# EasyEDA schematic SCH_MY-first-PCB_2026-09-03.json
TITLE: 5V Linear Power Supply; REV: 1.0; Date: 2026-09-03; Sheet: 1/1; Drawn By: Neeraj R; Company: neeraj-r-io
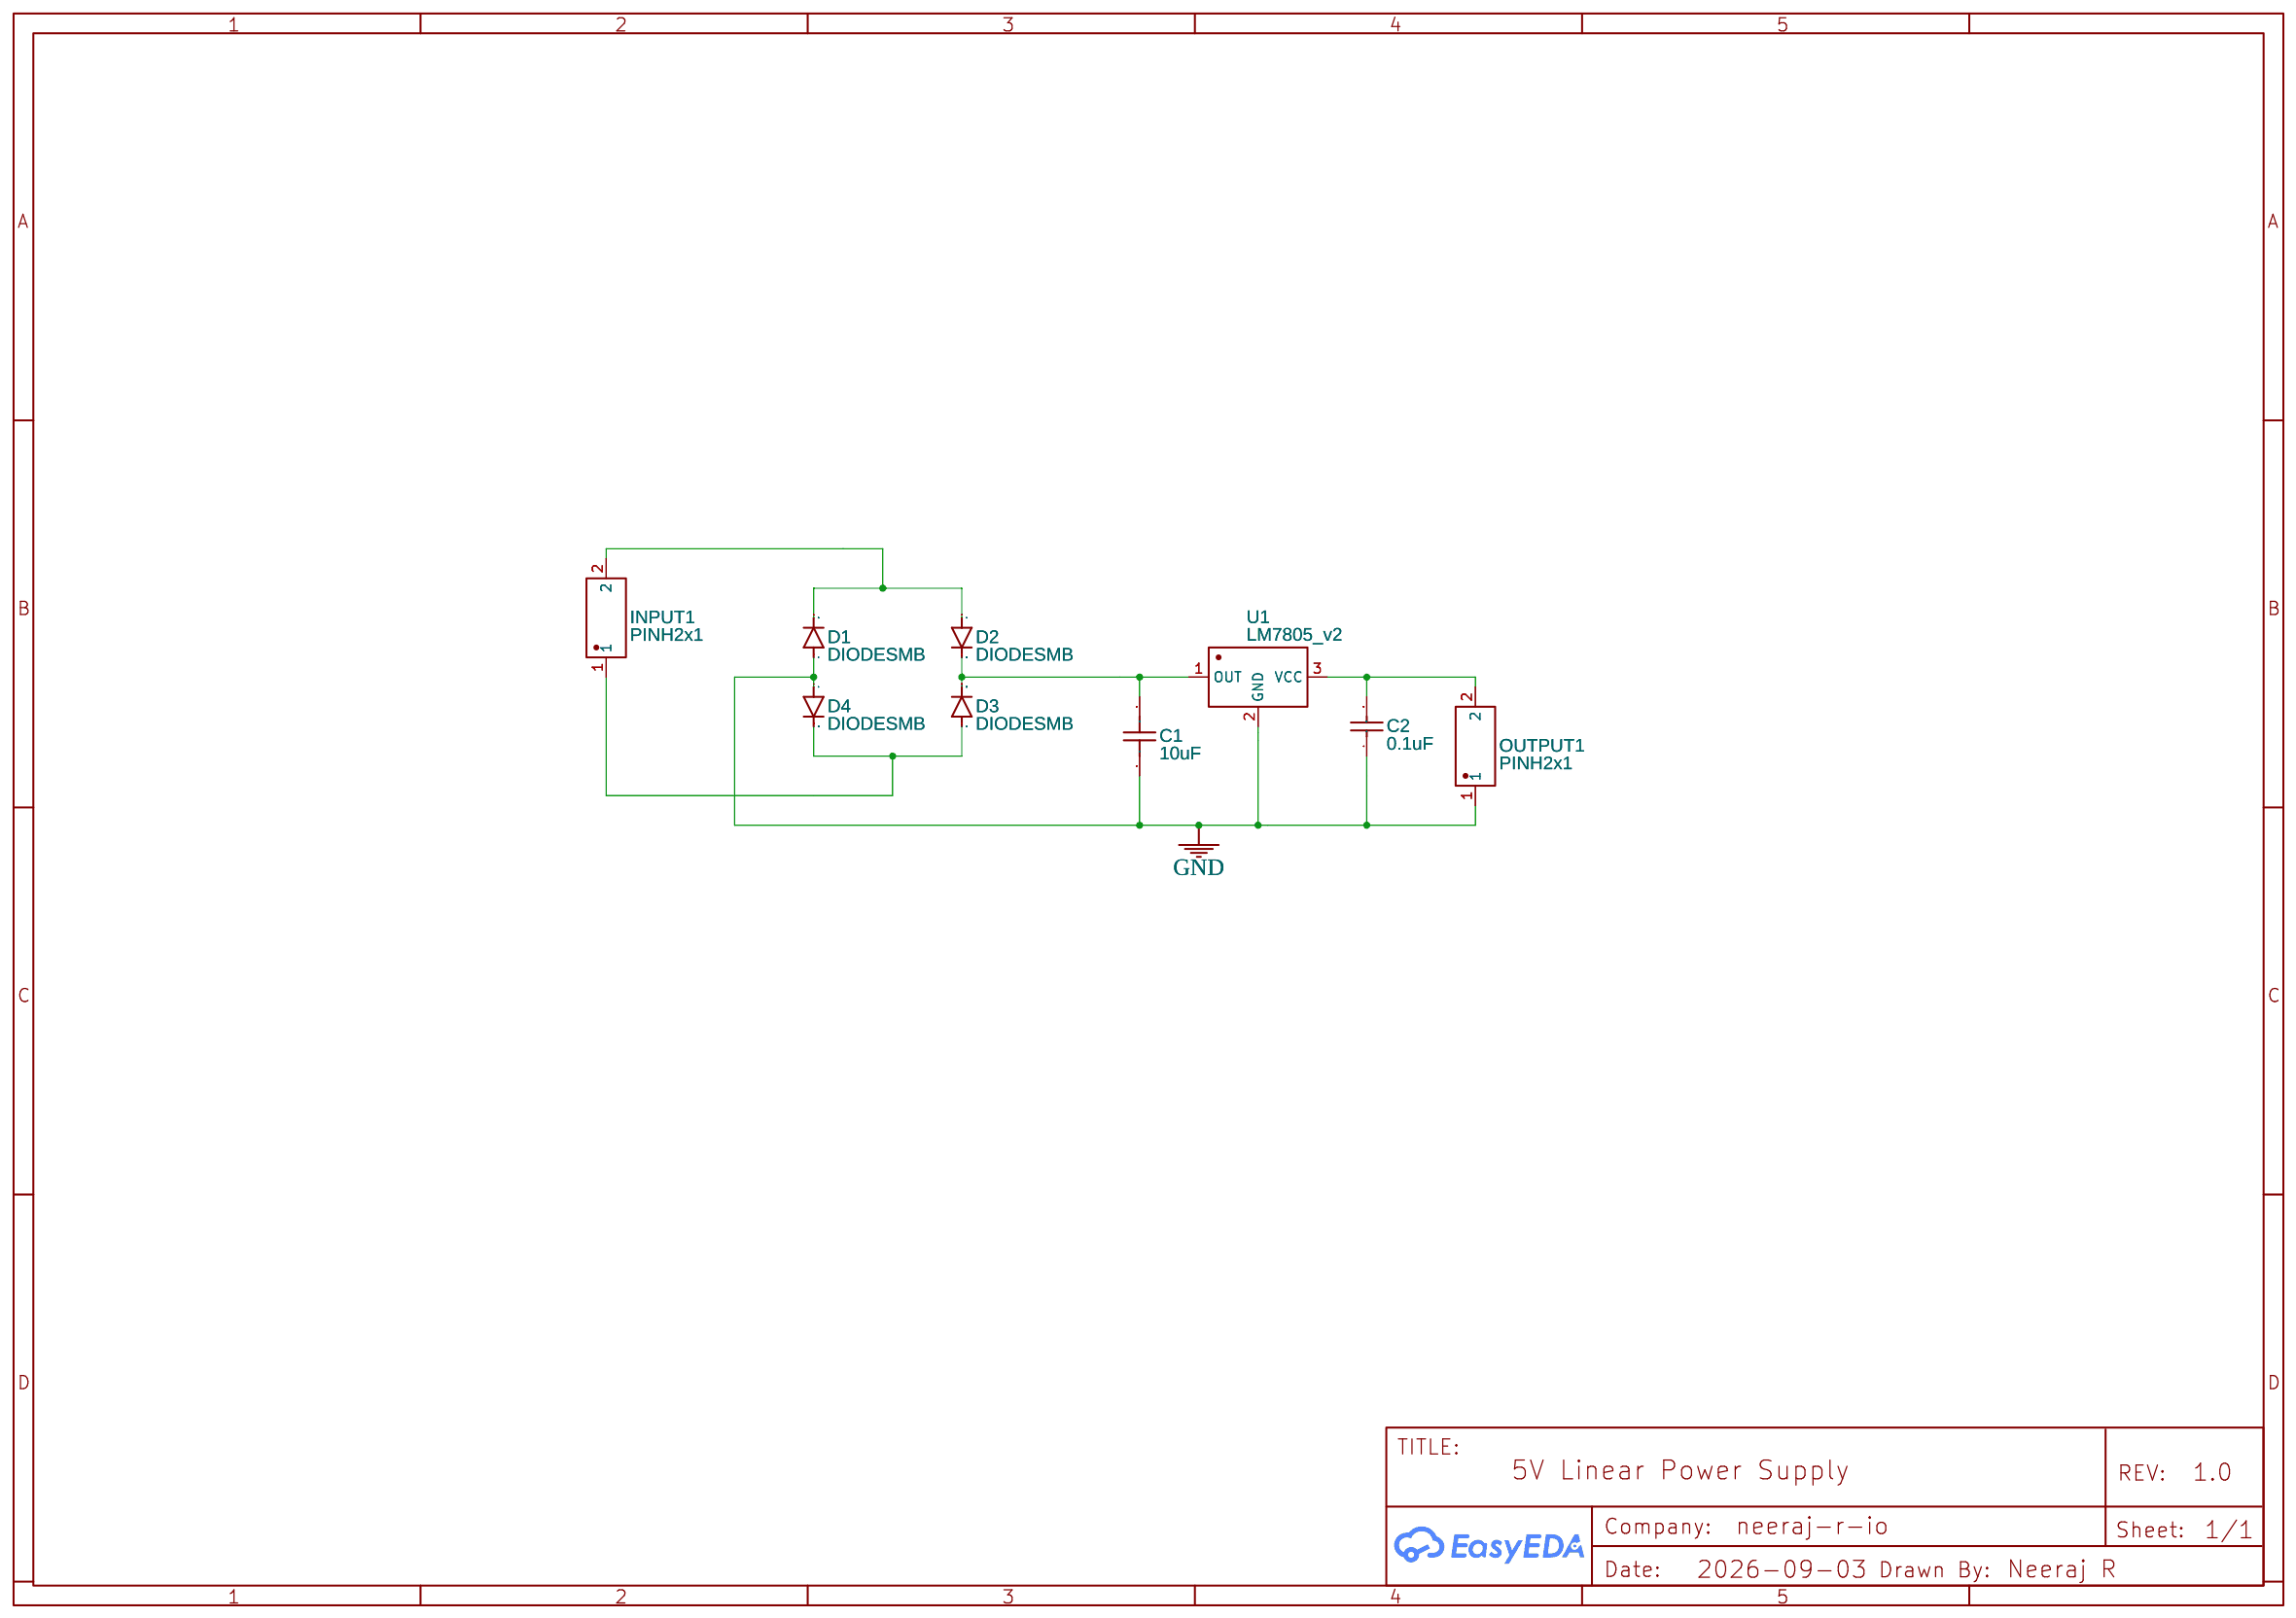
[diagram p0: schematic sheet]

## Parts
C1  10uF  [CAPACITOR, 2.54MM PIN CAPACITOR]
C2  0.1uF  [CAPACITOR-0.1UF-400V]
D1  DIODESMB  [SMB-DIODE]
D2  DIODESMB  [SMB-DIODE]
D3  DIODESMB  [SMB-DIODE]
D4  DIODESMB  [SMB-DIODE]
INPUT1  PINH2x1  [PINHEADER_2X1]
OUTPUT1  PINH2x1  [PINHEADER_2X1]
U1  LM7805_v2  [LM7805-FP]

## Library data of the parts
C1 = C_0603_US: Contributor: gayatridukare083
C2 = CAPACITOR-0.1uF-400V: Supplier Part: C26191; Supplier: LCSC; Manufacturer: ReliaPro; Manufacturer Part: Capacitor15nf100v; Contributor: david_wilkinson
D1-D4 = DIODESMB: Diode; Contributor: SparkFun
INPUT1 OUTPUT1 = PINH2x1: Contributor: LeynaertV
U1 = LM7805_v2: Contributor: s211151304

## Nets
GND: C1.2 C2.1 D1.A D4.A OUTPUT1.1 U1.2(GND)
Net-(C1-1): C1.1 D2.C D3.C U1.1(OUT)
Net-(C2-2): C2.2 OUTPUT1.2 U1.3(VCC)
Net-(D1-C): D1.C D2.A INPUT1.2
Net-(D3-A): D3.A D4.C INPUT1.1
